# EAGLE design board (EAGLE 9.6.2)
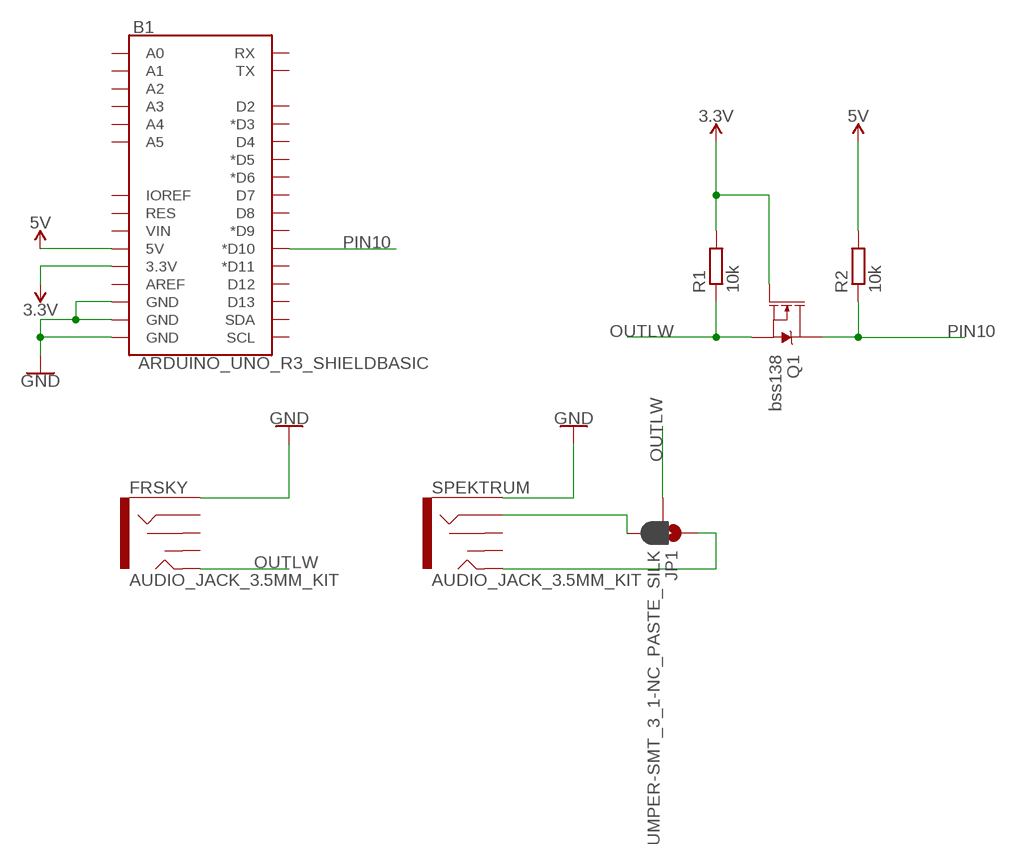
[diagram p0: schematic, sheet 1]

## Parts
B1  ARDUINO_UNO_R3_SHIELDBASIC  [UNO_R3_SHIELD]
FRSKY  AUDIO_JACK_3.5MM_KIT  [AUDIO-JACK-KIT]
JP1  JUMPER-SMT_3_1-NC_PASTE_SILK  [SMT-JUMPER_3_1-NC_PASTE_SILK]
Q1  bss138  MOSFET-NCH-AO3404A  [SOT23-3]
R1  10k  R-EU_R1206  [R1206]
R2  10k  R-EU_R1206  [R1206]
SPEKTRUM  AUDIO_JACK_3.5MM_KIT  [AUDIO-JACK-KIT]

## Nets
3.3V: B1.3.3V Q1.1(G) R1.2
5V: B1.5V R2.2
GND: B1.GND@0(GND) B1.GND@1(GND) B1.GND@2(GND) FRSKY.SLEEVE SPEKTRUM.SLEEVE
N$1: JP1.1 SPEKTRUM.TIP
N$2: JP1.3 SPEKTRUM.RING
OUTLW: FRSKY.TIP JP1.2 Q1.2(S) R1.1
PIN10: B1.D10(*D10) Q1.3(D) R2.1
Unconnected: B1.A0 B1.A1 B1.A2 B1.A3 B1.A4 B1.A5 B1.AREF B1.D2 B1.D3(*D3) B1.D4 B1.D5(*D5) B1.D6(*D6) B1.D7 B1.D8 B1.D9(*D9) B1.D11(*D11) B1.D12 B1.D13 B1.IOREF B1.RES B1.RX B1.SCL B1.SDA B1.TX B1.VIN FRSKY.RING FRSKY.RSH FRSKY.TSH SPEKTRUM.RSH SPEKTRUM.TSH

## Library data of the parts
B1 = SparkFun-Boards:ARDUINO_UNO_R3_SHIELD: Arduino R3 Shield Footprint Shield form compatible with the Arduino Uno R3. SparkFun Products: MG2639 Cellular Shield <https://www.sparkfun.com/products/13120> MIDI Shield <https://www.sparkfun.com/products/12898> R3 Stackable Headers Kit <https://www.sparkfun.com/products/11417>
FRSKY SPEKTRUM = SparkFun-Connectors:AUDIO_JACK_3.5MM: Audio Jack 3.5mm variants of PTH and SMT stereo audio jack with bypass switches. SparkFun Products: SparkFun SparkPunk Sound Kit <[https://www.sparkfun.com/products/11177]> - PTH MP3 Trigger <https://www.sparkfun.com/products/13720> -3.5mm SMD SparkFun PicoBoard <https://www.sparkfun.com/products/11888>- 2.5mm SMD; PROD_ID: CONN-08774; SF_ID: PRT-08032
JP1 = SparkFun-Jumpers:JUMPER-SMT_3_1-NC_PASTE: Normally closed solder jumper (1 of 2 connections) This jumper has an aperture in the stencil to allow solder paste to bridge one of the two connections. One connection is normally closed (NC), while the other is normally open (NO). Wick off the solder to open the connection. Reapply solder to reclose the connection. Apply solder to the other side instead to change the current path.
Q1 = SparkFun-DiscreteSemi:MOSFET-NCH: N-channel MOSFETs Voltage controlled devices that allow control of high current outputs. SparkFun Products: SparkFun OpenScale <https://www.sparkfun.com/products/13261> SparkFun Digital Sandbox <https://www.sparkfun.com/products/12651> SparkFun Monster Moto Shield <https://www.sparkfun.com/products/10182> SparkFun MOSFET Power Controller <https://www.sparkfun.com/products/11214>; PROD_ID: TRANS-12988; VALUE: 5.8A/30V/35mΩ
R1 R2 = rcl:R-EU_: RESISTOR, European symbol; SPICEPREFIX: R

## Board
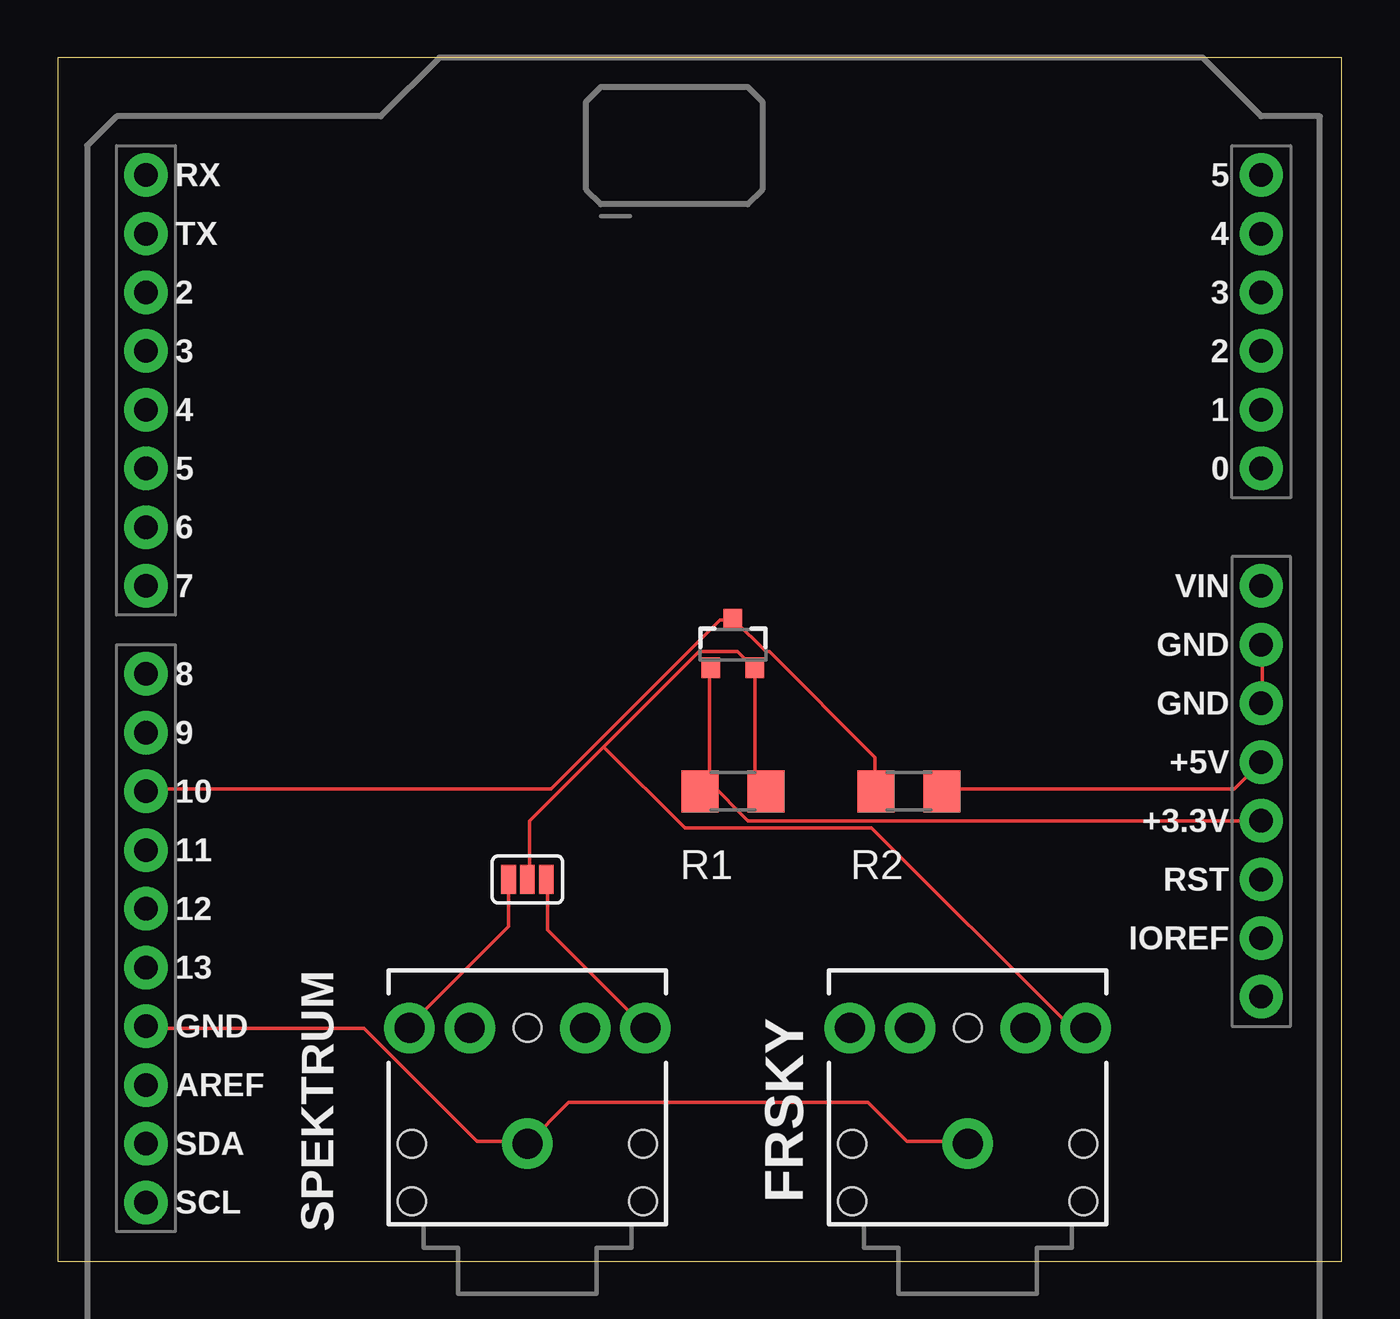
[diagram p1: board, top side]
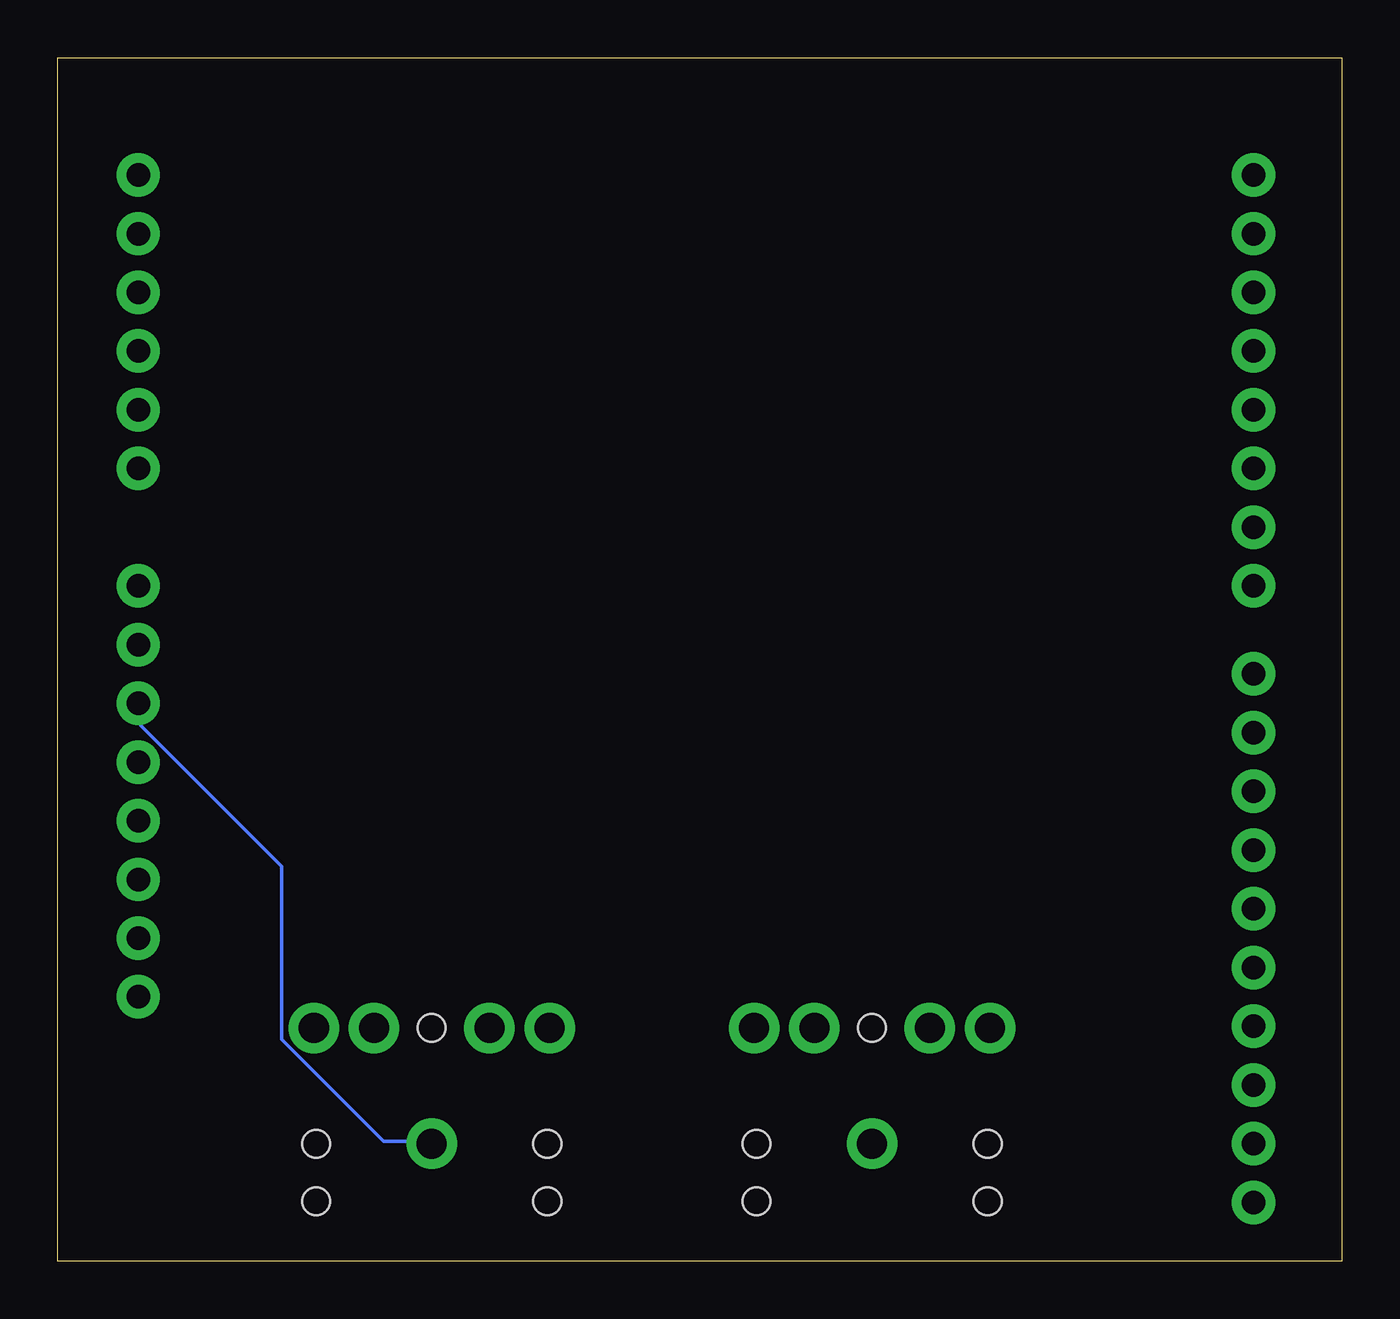
[diagram p2: board, bottom side, seen from below]

Size 55.55 x 52.06 mm. Coordinates in mm from the lower left corner, seen from the top.
Outline: 0,0 55.55,0 55.55,52.06 0,52.06 0,0
Copper layers (1*16): Top 0.035mm / dielectric 1.5mm / Bottom 0.035mm
Design rules "default": minimum track width 6mil, minimum drill 0.35mm, track to track 6mil, track to pad 6mil, pad to pad 6mil, via to via 6mil, smd to smd 6mil, copper to edge 40mil, drill to drill 6mil, minimum pad ring 10mil, minimum via ring 8mil, stop-mask expansion 4mil, vias tented up to drill 0mil, thermal gap 10mil

### Footprints (pad centres in the part's own frame; a part is rotated, then mirrored left to right if it is on the bottom)
UNO_R3_SHIELD = drill 1.016 pad 1.88: 3.3V 24.13,-2.54; 5V 24.13,0; A0 24.13,12.7; A1 24.13,15.24; A2 24.13,17.78; A3 24.13,20.32; A4 24.13,22.86; A5 24.13,25.4; AREF -24.13,-13.97; D2 -24.13,20.32; D3 -24.13,17.78; D4 -24.13,15.24; D5 -24.13,12.7; D6 -24.13,10.16; D7 -24.13,7.62; D8 -24.13,3.81; D9 -24.13,1.27; D10 -24.13,-1.27; D11 -24.13,-3.81; D12 -24.13,-6.35; D13 -24.13,-8.89; GND@0 24.13,2.54; GND@1 24.13,5.08; GND@2 -24.13,-11.43; IOREF 24.13,-7.62; NC 24.13,-10.16; RES 24.13,-5.08; RX -24.13,25.4; SCL -24.13,-19.05; SDA -24.13,-16.51; TX -24.13,22.86; VIN 24.13,7.62
AUDIO-JACK-KIT = drill 1.3 pad 2.184: RING 5,5.1; RSH 5,2.5; SLEEVE 0,0; TIP 5,-5.1; TSH 5,-2.5 | hole 1.2: 0,5; -2.5,5; -2.5,-5; 0,-5; 5,0
SMT-JUMPER_3_1-NC_PASTE_SILK = smd 0.635 x 1.27: 1 -0.813,0; 2 0,0; 3 0.813,0
SOT23-3 = smd 0.8 x 0.9: 1 -0.95,-1; 2 0.95,-1; 3 0,1.1
R1206 = smd 1.6 x 1.803: 1 -1.422,0; 2 1.422,0

### Placement (x,y rotation side)
B1  27.94,21.59 0 top
FRSKY  39.37,5.08 90 top
JP1  20.32,16.51 180 top
Q1  29.21,26.67 0 top
R1  29.21,20.32 180 top
R2  36.83,20.32 0 top
SPEKTRUM  20.32,5.08 90 top

### Tracks (layer width: path | path; a pad name or v marks a point on that pad's centre or on a via)
3.3V
  Top 0.152: 28.19,20.73 28.19,25.6 Q1.1 | 28.19,20.73 27.89,20.42 R1.2 28.19,20.73 | 28.19,20.73 29.87,19.05 B1.3.3V
5V
  Top 0.152: B1.5V 50.9,20.42 38.25,20.42 R2.2
GND
  Top 0.152: B1.GND@0 52.12,24.23 52.12,26.67 B1.GND@1 | B1.GND@2 3.81,10.06 13.26,10.06 18.14,5.18 20.27,5.18 SPEKTRUM.SLEEVE 22.1,6.86 35.05,6.86 36.73,5.18 39.32,5.18 FRSKY.SLEEVE
  Bottom 0.152: B1.GND@0 51.97,24.08 51.97,23.16 45.87,17.07 45.87,9.6 41.45,5.18 39.47,5.18 FRSKY.SLEEVE
N$1
  Top 0.152: JP1.1 21.18,16.46 21.18,14.33 25.3,10.21 SPEKTRUM.TIP
N$2
  Top 0.152: JP1.3 19.51,14.48 15.24,10.21 SPEKTRUM.RING
OUTLW
  Top 0.152: R1.1 30.48,20.42 30.18,20.73 30.18,25.6 Q1.2 30.02,25.76 29.41,26.36 27.74,26.36 23.62,22.25 | 23.62,22.25 20.42,19.05 20.42,16.61 JP1.2 | 23.62,22.25 27.13,18.75 35.2,18.75 43.74,10.21 44.35,10.21 FRSKY.TIP
PIN10
  Top 0.152: R2.1 35.36,20.42 35.36,21.79 30.79,26.36 30.63,26.36 29.26,27.74 Q1.3 29.11,27.74 28.65,27.74 21.34,20.42 3.81,20.42 B1.D10